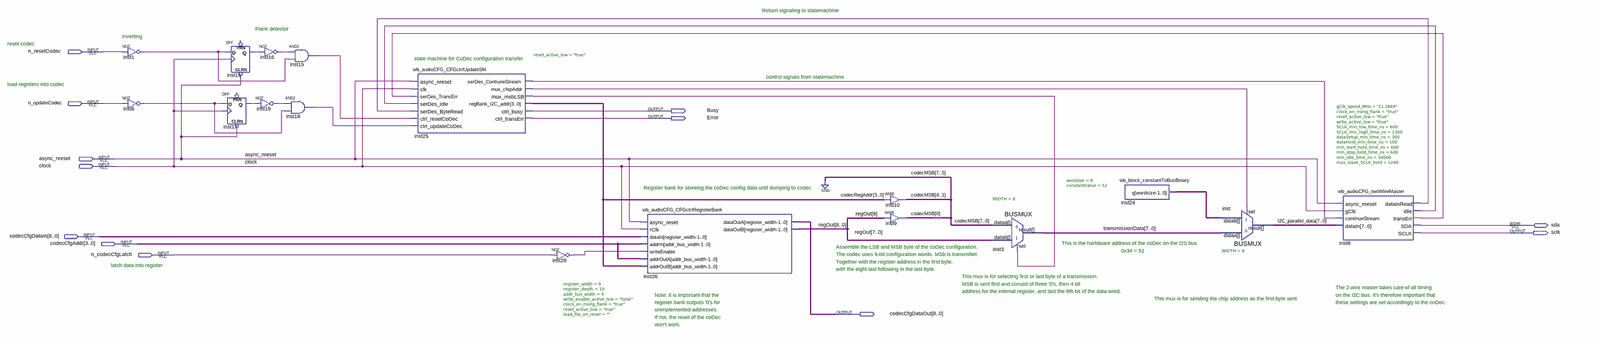
[diagram p0: schematic sheet, whole]
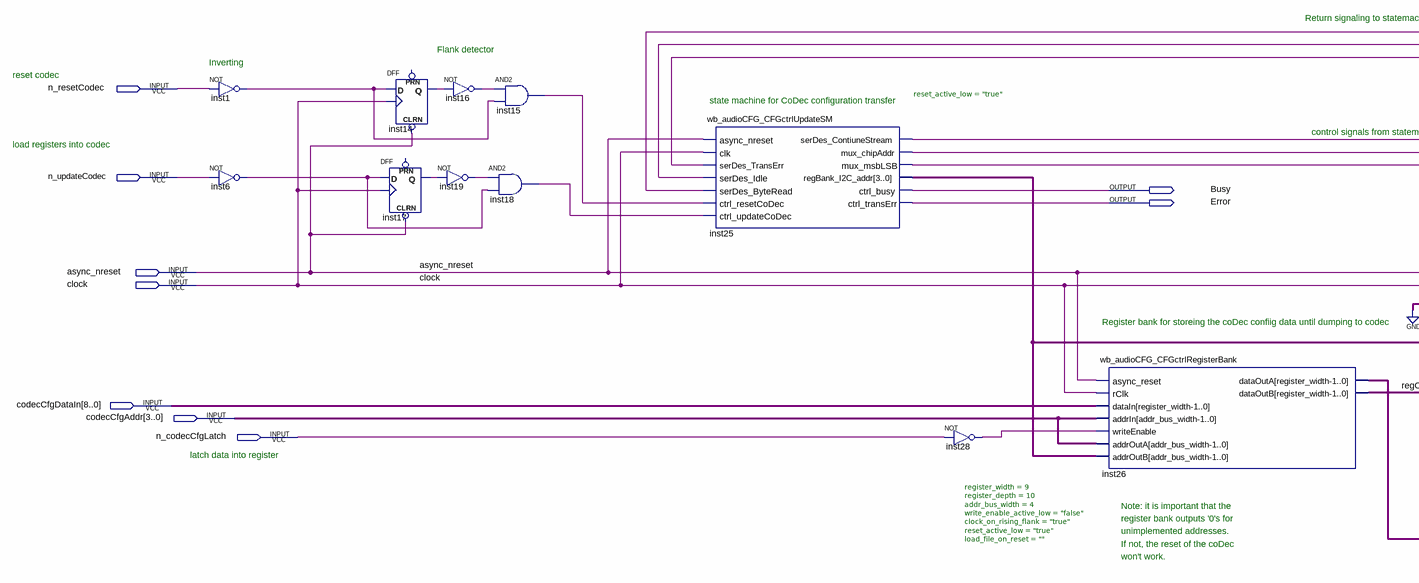
[diagram p1: schematic sheet, left part]
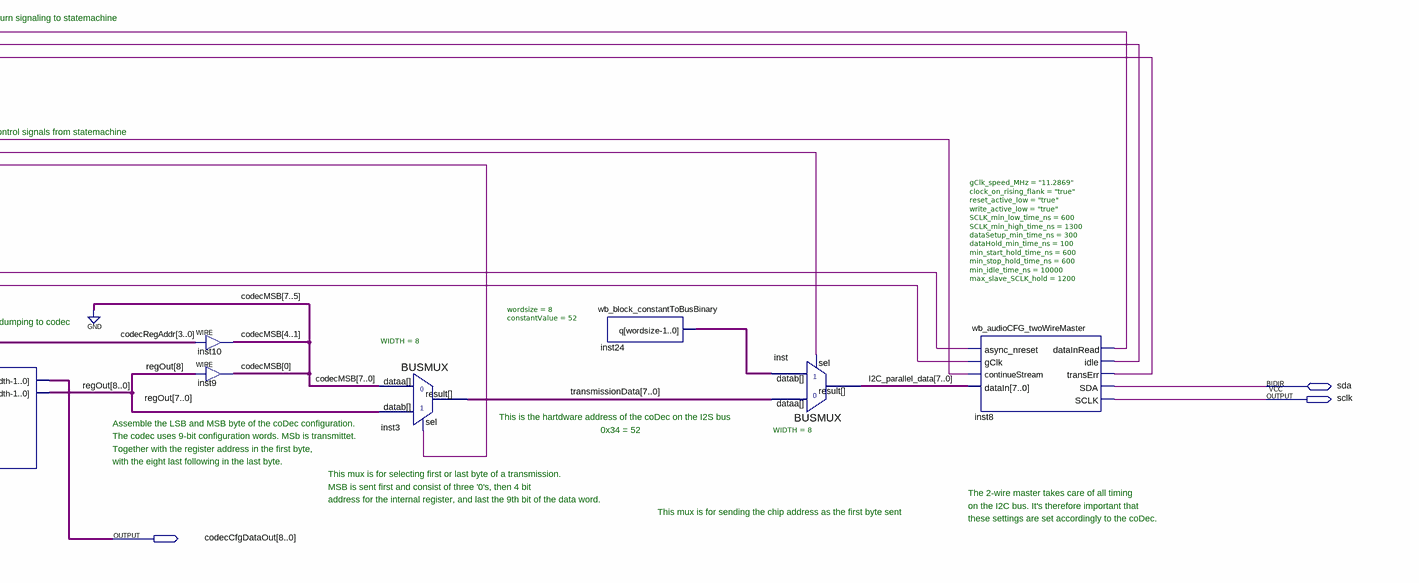
[diagram p2: schematic sheet, right part]
// Quartus schematic wb_audioCFG_CFGctrl.bdf as structural Verilog: 17 symbols, 12 pins
module wb_audioCFG_CFGctrl (
  input  n_resetCodec,
  input  n_updateCodec,
  input  async_nreset,
  input  clock,
  input  [8:0] codecCfgDataIn,
  input  [3:0] codecCfgAddr,
  input  n_codecCfgLatch,
  inout  sda,
  output Busy,
  output Error,
  output sclk,
  output [8:0] codecCfgDataOut
);

  wire inst1_out, inst6_out, inst8_datainread, inst8_idle, inst8_transerr, inst14_q, inst15_out, inst16_out,
       inst17_q, inst18_out, inst19_out, inst25_mux_chipaddr, inst25_mux_msblsb,
       inst25_serdes_contiunestream, inst28_out;
  wire [3:0] codecRegAddr;
  wire [4:0] codecMSB;
  wire [7:0] I2C_parallel_data, inst24_q, transmissionData;
  wire [8:0] regOut;

  not inst1 (inst1_out, n_resetCodec);
  not inst6 (inst6_out, n_updateCodec);
  DFF inst14 (.CLRN(async_nreset), .CLK(clock), .D(inst1_out), .Q(inst14_q));  // open: PRN
  DFF inst17 (.CLRN(async_nreset), .CLK(clock), .D(inst6_out), .Q(inst17_q));  // open: PRN
  not inst16 (inst16_out, inst14_q);
  not inst19 (inst19_out, inst17_q);
  and inst15 (inst15_out, inst16_out, inst1_out);
  and inst18 (inst18_out, inst19_out, inst6_out);
  wb_audioCFG_CFGctrlUpdateSM #(.reset_active_low("true")) inst25 (
    .async_nreset(async_nreset), .clk(clock), .serDes_TransErr(inst8_transerr), .serDes_Idle(inst8_idle),
    .serDes_ByteRead(inst8_datainread), .ctrl_resetCoDec(inst15_out), .ctrl_updateCoDec(inst18_out),
    .serDes_ContiuneStream(inst25_serdes_contiunestream), .mux_chipAddr(inst25_mux_chipaddr),
    .mux_msbLSB(inst25_mux_msblsb), .regBank_I2C_addr(codecRegAddr), .ctrl_busy(Busy), .ctrl_transErr(Error));
  not inst28 (inst28_out, n_codecCfgLatch);
  wb_audioCFG_CFGctrlRegisterBank #(.register_width(9), .register_depth(10), .addr_bus_width(4), .write_enable_active_low("false"), .clock_on_rising_flank("true"), .reset_active_low("true"), .load_file_on_reset("")) inst26 (
    .async_reset(async_nreset), .rClk(clock), .dataIn(codecCfgDataIn), .addrIn(codecCfgAddr),
    .writeEnable(inst28_out), .addrOutA(codecCfgAddr), .addrOutB(codecRegAddr), .dataOutA(codecCfgDataOut),
    .dataOutB(regOut));
  assign codecMSB[4:1] = codecRegAddr;  // WIRE inst10
  assign codecMSB[0] = regOut[8];  // WIRE inst9
  BUSMUX #(.WIDTH(8)) inst3 (
    .datab(regOut[7:0]), .sel(inst25_mux_msblsb), .dataa({3'b000, codecMSB}), .result(transmissionData));
  wb_block_constantToBusBinary #(.wordsize(8), .constantValue(52)) inst24 (.q(inst24_q));
  BUSMUX #(.WIDTH(8)) inst (
    .datab(inst24_q), .sel(inst25_mux_chipaddr), .dataa(transmissionData), .result(I2C_parallel_data));
  wb_audioCFG_twoWireMaster #(.gClk_speed_MHz("11.2869"), .clock_on_rising_flank("true"), .reset_active_low("true"), .write_active_low("true"), .SCLK_min_low_time_ns(600), .SCLK_min_high_time_ns(1300), .dataSetup_min_time_ns(300), .dataHold_min_time_ns(100), .min_start_hold_time_ns(600), .min_stop_hold_time_ns(600), .min_idle_time_ns(10000), .max_slave_SCLK_hold(1200)) inst8 (
    .async_nreset(async_nreset), .gClk(clock), .continueStream(inst25_serdes_contiunestream),
    .dataIn(I2C_parallel_data), .dataInRead(inst8_datainread), .idle(inst8_idle), .transErr(inst8_transerr),
    .SCLK(sclk), .SDA(sda));

  // Notes on the sheet:
  //   Return signaling to statemachine
  //   Flank detector
  //   Inverting
  //   reset codec
  //   state machine for CoDec configuration transfer
  //   control signals from statemachine
  //   load registers into codec
  //   Register bank for storeing the coDec confiig data until dumping to codec
  //   This is the hartdware address of the coDec on the I2S bus
  //   Assemble the LSB and MSB byte of the coDec configuration.
  //   0x34 = 52
  //   The codec uses 9-bit configuration words. MSb is transmittet.
  //   Together with the register address in the first byte,
  //   latch data into register
  //   with the eight last following in the last byte.
  //   This mux is for selecting first or last byte of a transmission.
  //   MSB is sent first and consist of three '0's, then 4 bit
  //   The 2-wire master takes care of all timing
  //   address for the internal register, and last the 9th bit of the data word.
  //   Note: it is important that the
  //   on the I2C bus. It's therefore important that
  //   This mux is for sending the chip address as the first byte sent
  //   register bank outputs '0's for
  //   these settings are set accordingly to the coDec.
  //   unimplemented addresses.
  //   If not, the reset of the coDec
  //   won't work.
endmodule
